# Altium schematic sheet ADC.SchDoc
size A4
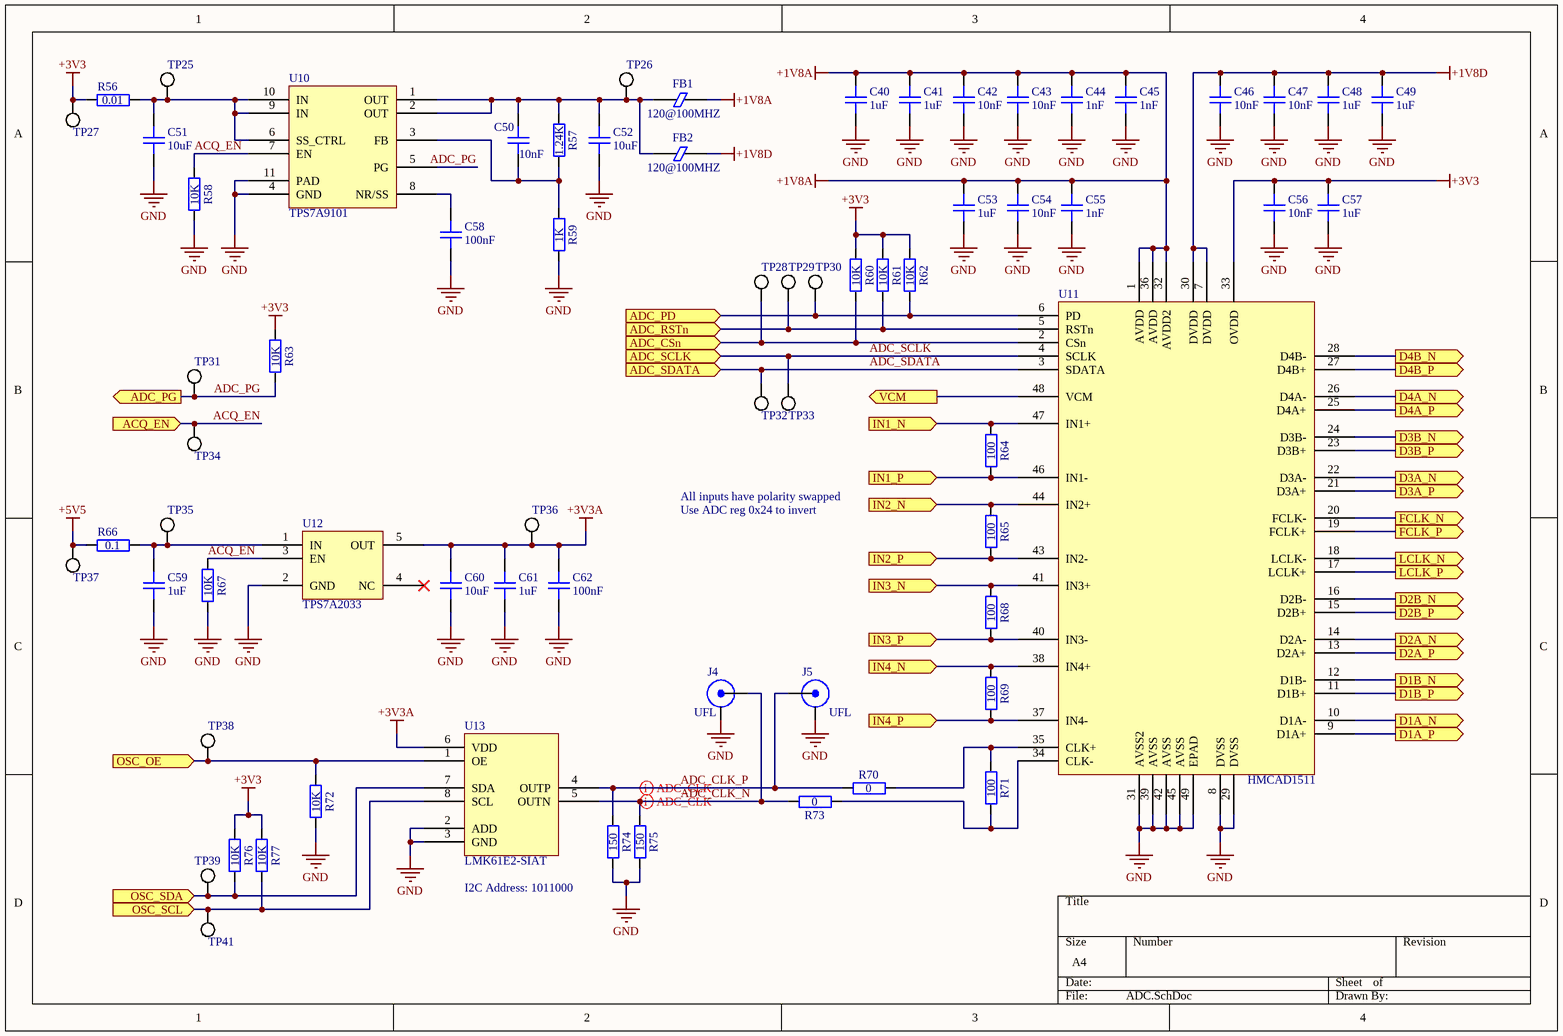
[diagram p0: ADC.SchDoc]

## Parts
C40  1uF  [GEN_C_0402]
C41  1uF  [GEN_C_0402]
C42  10nF  [GEN_C_0402]
C43  10nF  [GEN_C_0402]
C44  1nF  [GEN_C_0402]
C45  1nF  [GEN_C_0402]
C46  10nF  [GEN_C_0402]
C47  10nF  [GEN_C_0402]
C48  1uF  [GEN_C_0402]
C49  1uF  [GEN_C_0402]
C50  10nF  [GEN_C_0402]
C51  10uF  [GEN_C_0603]
C52  10uF  [GEN_C_0603]
C53  1uF  [GEN_C_0402]
C54  10nF  [GEN_C_0402]
C55  1nF  [GEN_C_0402]
C56  10nF  [GEN_C_0402]
C57  1uF  [GEN_C_0402]
C58  100nF  [GEN_C_0402]
C59  1uF  [GEN_C_0402]
C60  10uF  [GEN_C_0603]
C61  1uF  [GEN_C_0402]
C62  100nF  [GEN_C_0402]
FB1  120@100MHZ  [GEN_R_0402]
FB2  120@100MHZ  [GEN_R_0402]
J4  UFL  [TE_2334884-1]
J5  UFL  [TE_2334884-1]
R56  0.01  [GEN_R_0603]
R57  1.24K  [GEN_R_0402]
R58  10K  [GEN_R_0402]
R59  1K  [GEN_R_0402]
R60  10K  [GEN_R_0402]
R61  10K  [GEN_R_0402]
R62  10K  [GEN_R_0402]
R63  10K  [GEN_R_0402]
R64  100  [GEN_R_0402]
R65  100  [GEN_R_0402]
R66  0.1  [GEN_R_0402]
R67  10K  [GEN_R_0402]
R68  100  [GEN_R_0402]
R69  100  [GEN_R_0402]
R70  0  [GEN_R_0402]
R71  100  [GEN_R_0402]
R72  10K  [GEN_R_0402]
R73  0  [GEN_R_0402]
R74  150  [GEN_R_0402]
R75  150  [GEN_R_0402]
R76  10K  [GEN_R_0402]
R77  10K  [GEN_R_0402]
TP25  PCB  [GEN_TP_PCB]  (value not drawn)  (no BOM)
TP26  PCB  [GEN_TP_PCB]  (value not drawn)  (no BOM)
TP27  PCB  [GEN_TP_PCB]  (value not drawn)  (no BOM)
TP28  PCB  [GEN_TP_PCB]  (value not drawn)  (no BOM)
TP29  PCB  [GEN_TP_PCB]  (value not drawn)  (no BOM)
TP30  PCB  [GEN_TP_PCB]  (value not drawn)  (no BOM)
TP31  PCB  [GEN_TP_PCB]  (value not drawn)  (no BOM)
TP32  PCB  [GEN_TP_PCB]  (value not drawn)  (no BOM)
TP33  PCB  [GEN_TP_PCB]  (value not drawn)  (no BOM)
TP34  PCB  [GEN_TP_PCB]  (value not drawn)  (no BOM)
TP35  PCB  [GEN_TP_PCB]  (value not drawn)  (no BOM)
TP36  PCB  [GEN_TP_PCB]  (value not drawn)  (no BOM)
TP37  PCB  [GEN_TP_PCB]  (value not drawn)  (no BOM)
TP38  PCB  [GEN_TP_PCB]  (value not drawn)  (no BOM)
TP39  PCB  [GEN_TP_PCB]  (value not drawn)  (no BOM)
TP41  PCB  [GEN_TP_PCB]  (value not drawn)  (no BOM)
U10  TPS7A9101  [TI_WSON10_DSK0010A]
U11  HMCAD1511  [AD_QFN48_LP7]
U12  TPS7A2033  [GEN_SOT23_5_950_2900X1600X1450]
U13  LMK61E2-SIAT  [TI_QFM8_SIA0008B]

## Ports
ACQ_EN (in), ADC_CSn (in), ADC_PD (in), ADC_PG (out), ADC_RSTn (in), ADC_SCLK (in), ADC_SDATA (in), D1A_N (out), D1A_P (out), D1B_N (out), D1B_P (out), D2A_N (out), D2A_P (out), D2B_N (out), D2B_P (out), D3A_N (out), D3A_P (out), D3B_N (out), D3B_P (out), D4A_N (out), D4A_P (out), D4B_N (out), D4B_P (out), FCLK_N (out), FCLK_P (out), IN1_N (in), IN1_P (in), IN2_N (in), IN2_P (in), IN3_N (in), IN3_P (in), IN4_N (in), IN4_P (in), LCLK_N (out), LCLK_P (out), OSC_OE (in), OSC_SCL (in), OSC_SDA (in), VCM (out)

## Nets
+1V8A: C40.2 C41.2 C42.2 C43.2 C44.2 C45.2 C53.2 C54.2 C55.2 FB1.2 U11.1(AVDD) U11.32(AVDD2) U11.36(AVDD)
+1V8D: C46.2 C47.2 C48.2 C49.2 FB2.2 U11.7(DVDD) U11.30(DVDD)
+3V3: C56.2 C57.2 R56.1 R60.2 R61.2 R62.2 R63.2 R76.2 R77.2 TP27.1 U11.33(OVDD)
+3V3A: C60.2 C61.2 C62.2 TP36.1 U12.5(OUT) U13.6(VDD)
+5V5: R66.1 TP37.1
GND: C40.1 C41.1 C42.1 C43.1 C44.1 C45.1 C46.1 C47.1 C48.1 C49.1 C51.1 C52.1 C53.1 C54.1 C55.1 C56.1 C57.1 C58.1 C59.1 C60.1 C61.1 C62.1 J4.2(SHIELD) J5.2(SHIELD) R58.1 R59.1 R67.1 R72.1 R74.1 R75.1 U10.4(GND) U10.11(PAD) U11.8(DVSS) U11.29(DVSS) U11.31(AVSS2) U11.39(AVSS) U11.42(AVSS) U11.45(AVSS) U11.49(EPAD) U12.2(GND) U13.2(ADD) U13.3(GND)
ACQ_EN: R58.2 R67.2 TP34.1 U10.7(EN) U12.3(EN) ; port ACQ_EN
ADC_CLK_N: J4.1(Signal) R73.1 R75.2 U13.5(OUTN)
ADC_CLK_P: J5.1(Signal) R70.1 R74.2 U13.4(OUTP)
ADC_CSn: R60.1 TP28.1 U11.2(CSn) ; port ADC_CSn
ADC_PD: R62.1 TP30.1 U11.6(PD) ; port ADC_PD
ADC_PG: R63.1 TP31.1 U10.5(PG) ; port ADC_PG
ADC_RSTn: R61.1 TP29.1 U11.5(RSTn) ; port ADC_RSTn
ADC_SCLK: TP33.1 U11.4(SCLK) ; port ADC_SCLK
ADC_SDATA: TP32.1 U11.3(SDATA) ; port ADC_SDATA
D1A_N: U11.10(D1A-) ; port D1A_N
D1A_P: U11.9(D1A+) ; port D1A_P
D1B_N: U11.12(D1B-) ; port D1B_N
D1B_P: U11.11(D1B+) ; port D1B_P
D2A_N: U11.14(D2A-) ; port D2A_N
D2A_P: U11.13(D2A+) ; port D2A_P
D2B_N: U11.16(D2B-) ; port D2B_N
D2B_P: U11.15(D2B+) ; port D2B_P
D3A_N: U11.22(D3A-) ; port D3A_N
D3A_P: U11.21(D3A+) ; port D3A_P
D3B_N: U11.24(D3B-) ; port D3B_N
D3B_P: U11.23(D3B+) ; port D3B_P
D4A_N: U11.26(D4A-) ; port D4A_N
D4A_P: U11.25(D4A+) ; port D4A_P
D4B_N: U11.28(D4B-) ; port D4B_N
D4B_P: U11.27(D4B+) ; port D4B_P
FCLK_N: U11.20(FCLK-) ; port FCLK_N
FCLK_P: U11.19(FCLK+) ; port FCLK_P
IN1_N: R64.2 U11.47(IN1+) ; port IN1_N
IN1_P: R64.1 U11.46(IN1-) ; port IN1_P
IN2_N: R65.2 U11.44(IN2+) ; port IN2_N
IN2_P: R65.1 U11.43(IN2-) ; port IN2_P
IN3_N: R68.2 U11.41(IN3+) ; port IN3_N
IN3_P: R68.1 U11.40(IN3-) ; port IN3_P
IN4_N: R69.2 U11.38(IN4+) ; port IN4_N
IN4_P: R69.1 U11.37(IN4-) ; port IN4_P
LCLK_N: U11.18(LCLK-) ; port LCLK_N
LCLK_P: U11.17(LCLK+) ; port LCLK_P
OSC_OE: R72.2 TP38.1 U13.1(OE) ; port OSC_OE
OSC_SCL: R77.1 TP41.1 U13.8(SCL) ; port OSC_SCL
OSC_SDA: R76.1 TP39.1 U13.7(SDA) ; port OSC_SDA
VCM: U11.48(VCM) ; port VCM
NetC50_1: C50.1 R57.1 R59.2 U10.3(FB)
NetC50_2: C50.2 C52.2 FB1.1 FB2.1 R57.2 TP26.1 U10.1(OUT) U10.2(OUT)
NetC51_2: C51.2 R56.2 TP25.1 U10.6(SS_CTRL) U10.9(IN) U10.10(IN)
NetC58_2: C58.2 U10.8(NR/SS)
NetC59_2: C59.2 R66.2 TP35.1 U12.1(IN)
NetR70_2: R70.2 R71.2 U11.35(CLK+)
NetR71_1: R71.1 R73.2 U11.34(CLK-)

Not connected (* = marked no-connect by the designer): U12 4(NC)*

## Layout directives
differential pair: ADC_CLK_N, ADC_CLK_P

## Notes on the sheet
- All inputs have polarity swapped
- Use ADC reg 0x24 to invert
- I2C Address: 1011000

## Library data of the parts
C40 C41 C48 C49 C53 C57 C59 C61 = CAP 1uF 25V X5R 0402: Voltage Rating: 25V; Package: 0402; Supplier 1: Digi-Key; Supplier Part Number 1: 490-10017-1-ND; Value: 1uF
C42 C43 C46 C47 C50 C54 C56 = CAP 10nF 50V X7R 0402: Voltage Rating: 50V; Package: 0402; Supplier 1: Digi-Key; Supplier Part Number 1: 490-4762-1-ND; Value: 10nF
C44 C45 C55 = CAP 1nF 50V C0G 0402: Voltage Rating: 50V; Package: 0402; Supplier 1: Digi-Key; Supplier Part Number 1: 490-6189-1-ND; Value: 1nF
C51 C52 C60 = CAP 10uF 10V X5R 0603: Voltage Rating: 10V; Package: 0402; Supplier 1: Digi-Key; Supplier Part Number 1: 490-10474-1-ND; Value: 10uF
C58 C62 = CAP 100nF 16V X7R 0402: Voltage Rating: 16V; Package: 0402; Supplier 1: Digi-Key; Supplier Part Number 1: 490-4759-1-ND; Value: 100nF
FB1 FB2 = FERRITE BEAD 120 OHM 0402: Supplier 1: Digi-Key; Supplier Part Number 1: 490-9656-1-ND
J4 J5 = UFL Jack SMD: Supplier 1: Digi-Key; Supplier Part Number 1: A145155CT-ND
R56 = RES 0.01 OHM 1% 1/4W 0603: Tolerance: 1%; Power Rating: 0.25W; Supplier 1: Digi-Key; Supplier Part Number 1: 408-1404-1-ND; Value: 0.01; Package: 0603
R57 = RES 1.24K OHM 1% 1/16W 0402: Tolerance: 1%; Power Rating: 0.0625W; Package: 0402; Value: 1.24K; Supplier 1: Digi-Key; Supplier Part Number 1: 311-1.24KLRCT-ND
R58 R60-R63 R67 R72 R76 R77 = RES 10K OHM 1% 1/10W 0402: Tolerance: 1%; Power Rating: 0.1W; Package: 0402; Supplier 1: Digi-Key; Supplier Part Number 1: P10.0KLCT-ND; Value: 10K
R59 = RES 1K OHM 1% 1/10W 0402: Tolerance: 1%; Power Rating: 0.1W; Package: 0402; Supplier 1: Digi-Key; Supplier Part Number 1: P1.00KLCT-ND; Value: 1K
R64 R65 R68 R69 R71 = RES 100 OHM 1% 1/10W 0402: Tolerance: 1%; Power Rating: 0.1W; Package: 0402; Value: 100; Supplier 1: Digi-Key; Supplier Part Number 1: P100LCT-ND
R66 = RES 0.1 OHM 1% 1/6W 0402: Tolerance: 1%; Power Rating: 0.16W; Package: 0402; Supplier 1: Digi-Key; Supplier Part Number 1: P.10AKCT-ND; Value: 0.1
R70 R73 = RES 0 OHM 1/16W 0402: Power Rating: 0.0625W; Package: 0402; Supplier 1: Digi-Key; Supplier Part Number 1: 311-0.0JRCT-ND; Value: 0
R74 R75 = RES 150 OHM 1% 1/16W 0402: Tolerance: 1%; Power Rating: 0.0625W; Package: 0402; Value: 150; Supplier 1: Digi-Key; Supplier Part Number 1: 311-150LRCT-ND
TP25-TP39 TP41 = TP PCB 1mm
U10 = IC LDO TPS7A9101: Supplier 1: Digi-Key; Supplier Part Number 1: 296-45298-1-ND
U11 = IC ADC HMCAD1511: Supplier 1: Digi-Key; Supplier Part Number 1: 1127-1648-ND
U12 = IC LDO TPS7A2033: Supplier 1: Digi-Key; Supplier Part Number 1: 296-TPS7A2033PDBVRCT-ND
U13 = IC PROG OSC LMK61E2-SIAT: Supplier 1: Digi-Key; Supplier Part Number 1: 296-43212-1-ND